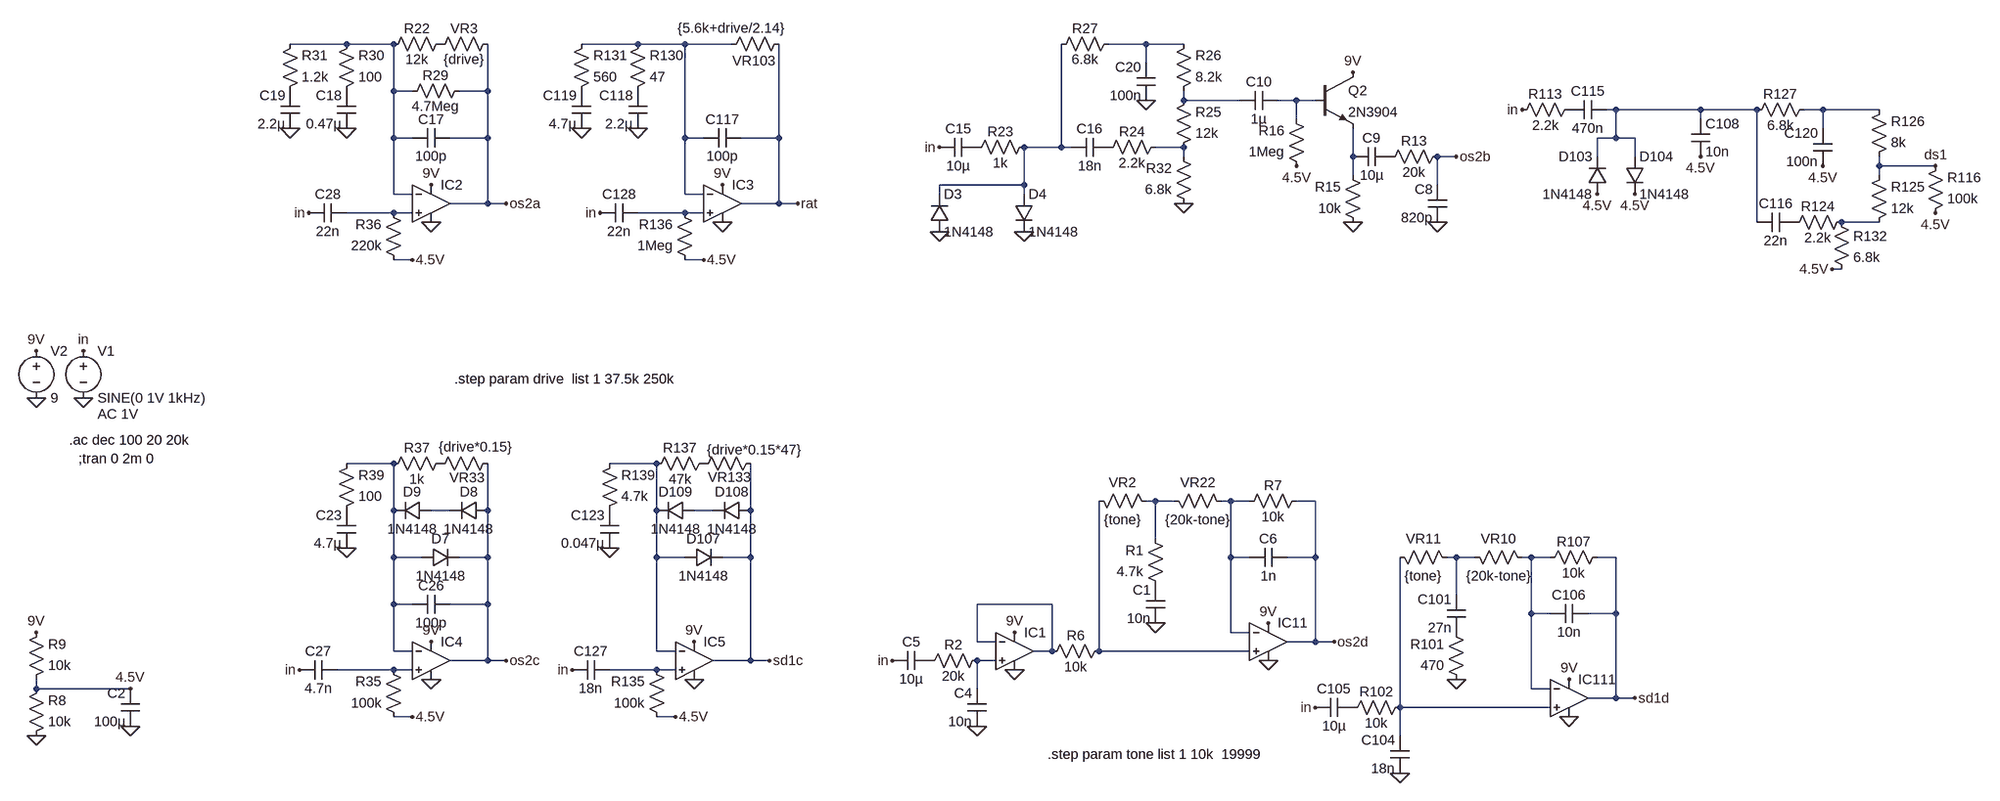
[diagram p0: schematic os2.asc]
os2.asc, the LTspice schematic file:
Version 4
SHEET 1 3148 2804
WIRE -1536 624 -1632 624
WIRE -1456 624 -1536 624
WIRE -1040 624 -1136 624
WIRE -960 624 -1040 624
WIRE -880 624 -960 624
WIRE -128 624 -192 624
WIRE -64 624 -128 624
WIRE -128 656 -128 624
WIRE -1456 704 -1456 624
WIRE -1424 704 -1456 704
WIRE -1296 704 -1296 624
WIRE -1296 704 -1344 704
WIRE -64 720 -64 704
WIRE 32 720 -64 720
WIRE 128 720 96 720
WIRE 160 720 128 720
WIRE 672 736 656 736
WIRE 816 736 672 736
WIRE 912 736 816 736
WIRE 1024 736 992 736
WIRE 1120 736 1024 736
WIRE 128 752 128 720
WIRE 816 752 816 736
WIRE 1024 768 1024 736
WIRE -1456 784 -1456 704
WIRE -1424 784 -1456 784
WIRE -1296 784 -1296 704
WIRE -1296 784 -1360 784
WIRE -960 784 -960 624
WIRE -928 784 -960 784
WIRE -800 784 -800 624
WIRE -800 784 -864 784
WIRE 672 784 672 736
WIRE 672 784 640 784
WIRE 704 784 672 784
WIRE -272 800 -272 624
WIRE -272 800 -336 800
WIRE -256 800 -272 800
WIRE -64 800 -112 800
WIRE -64 816 -64 800
WIRE 224 816 224 768
WIRE 400 816 368 816
WIRE 640 816 640 784
WIRE 704 816 704 784
WIRE 1120 832 1120 816
WIRE 1216 832 1120 832
WIRE 224 848 224 816
WIRE 1120 848 1120 832
WIRE -336 864 -336 800
WIRE -336 864 -480 864
WIRE 368 864 368 816
WIRE -1456 880 -1456 784
WIRE -1424 880 -1456 880
WIRE -960 880 -960 784
WIRE -928 880 -960 880
WIRE -480 880 -480 864
WIRE -336 880 -336 864
WIRE -1296 896 -1296 784
WIRE -1296 896 -1360 896
WIRE -1264 896 -1296 896
WIRE -800 896 -800 784
WIRE -800 896 -864 896
WIRE -768 896 -800 896
WIRE -1456 912 -1536 912
WIRE -1424 912 -1456 912
WIRE -960 912 -1040 912
WIRE -928 912 -960 912
WIRE 912 928 912 736
WIRE 1120 928 1056 928
WIRE -1424 992 -1456 992
WIRE -928 992 -960 992
WIRE 1056 1008 1040 1008
WIRE -1456 1376 -1536 1376
WIRE -1008 1376 -1088 1376
WIRE -112 1440 -128 1440
WIRE -80 1440 -112 1440
WIRE 16 1440 0 1440
WIRE 48 1440 16 1440
WIRE 160 1440 128 1440
WIRE -1456 1456 -1456 1376
WIRE -1360 1456 -1392 1456
WIRE -1296 1456 -1296 1376
WIRE -1008 1456 -1008 1376
WIRE -912 1456 -944 1456
WIRE -848 1456 -848 1376
WIRE -112 1504 -112 1440
WIRE -1456 1536 -1456 1456
WIRE -1408 1536 -1456 1536
WIRE -1296 1536 -1296 1456
WIRE -1296 1536 -1344 1536
WIRE -1008 1536 -1008 1456
WIRE -960 1536 -1008 1536
WIRE -848 1536 -848 1456
WIRE -848 1536 -896 1536
WIRE 16 1536 16 1440
WIRE 48 1536 16 1536
WIRE 160 1536 160 1440
WIRE 160 1536 112 1536
WIRE 400 1536 384 1536
WIRE 432 1536 400 1536
WIRE 528 1536 512 1536
WIRE 560 1536 528 1536
WIRE 672 1536 640 1536
WIRE 400 1600 400 1536
WIRE -1456 1616 -1456 1536
WIRE -1424 1616 -1456 1616
WIRE -1296 1616 -1296 1536
WIRE -1296 1616 -1360 1616
WIRE -288 1616 -416 1616
WIRE 528 1632 528 1536
WIRE 560 1632 528 1632
WIRE 672 1632 672 1536
WIRE 672 1632 624 1632
WIRE 16 1664 16 1536
WIRE 48 1664 16 1664
WIRE -416 1680 -416 1616
WIRE -384 1680 -416 1680
WIRE 160 1680 160 1536
WIRE 160 1680 112 1680
WIRE 192 1680 160 1680
WIRE -1456 1696 -1456 1616
WIRE -1424 1696 -1456 1696
WIRE -1008 1696 -1008 1536
WIRE -976 1696 -1008 1696
WIRE -288 1696 -288 1616
WIRE -288 1696 -320 1696
WIRE -208 1696 -208 1440
WIRE 48 1696 -208 1696
WIRE -1296 1712 -1296 1616
WIRE -1296 1712 -1360 1712
WIRE -1264 1712 -1296 1712
WIRE -848 1712 -848 1536
WIRE -848 1712 -912 1712
WIRE -816 1712 -848 1712
WIRE -384 1712 -416 1712
WIRE -1456 1728 -1552 1728
WIRE -1424 1728 -1456 1728
WIRE -1008 1728 -1088 1728
WIRE -976 1728 -1008 1728
WIRE -2064 1760 -2064 1744
WIRE -1904 1760 -2064 1760
WIRE -416 1760 -416 1712
WIRE 528 1760 528 1632
WIRE 560 1760 528 1760
WIRE 672 1776 672 1632
WIRE 672 1776 624 1776
WIRE 704 1776 672 1776
WIRE 304 1792 304 1536
WIRE 560 1792 304 1792
WIRE -1424 1808 -1456 1808
WIRE -976 1808 -1008 1808
WIRE 304 1840 304 1792
FLAG -1984 1264 0
FLAG -1984 1184 in
FLAG -1600 912 in
FLAG -2064 1840 0
FLAG -1904 1824 0
FLAG -1392 864 9V
FLAG -2064 1264 0
FLAG -2064 1184 9V
FLAG -2064 1664 9V
FLAG -1904 1760 4.5V
FLAG -1424 992 4.5V
FLAG -1536 768 0
FLAG -1632 768 0
FLAG -1392 928 0
FLAG -336 944 0
FLAG -480 944 0
FLAG -128 720 0
FLAG -64 896 0
FLAG 128 832 4.5V
FLAG 224 928 0
FLAG 224 672 9V
FLAG 368 928 0
FLAG -480 800 in
FLAG -1264 896 os2a
FLAG 400 816 os2b
FLAG -1616 1728 in
FLAG -1392 1680 9V
FLAG -1424 1808 4.5V
FLAG -1536 1520 0
FLAG -1392 1744 0
FLAG -416 1824 0
FLAG -1264 1712 os2c
FLAG 80 1648 9V
FLAG 80 1712 0
FLAG 192 1680 os2d
FLAG -112 1648 0
FLAG 640 880 4.5V
FLAG 704 880 4.5V
FLAG 816 816 4.5V
FLAG 1024 832 4.5V
FLAG 1040 1008 4.5V
FLAG 1216 832 ds1
FLAG 512 736 in
FLAG -1104 912 in
FLAG -896 864 9V
FLAG -928 992 4.5V
FLAG -1040 768 0
FLAG -1136 768 0
FLAG -896 928 0
FLAG -768 896 rat
FLAG -1152 1728 in
FLAG -944 1680 9V
FLAG -976 1808 4.5V
FLAG -1088 1520 0
FLAG -944 1744 0
FLAG -816 1712 sd1c
FLAG 304 1904 0
FLAG 592 1744 9V
FLAG 592 1808 0
FLAG 704 1776 sd1d
FLAG 400 1744 0
FLAG -352 1664 9V
FLAG -352 1728 0
FLAG 1216 912 4.5V
FLAG -560 1712 in
FLAG 160 1792 in
SYMBOL voltage -1984 1168 R0
WINDOW 123 24 124 Left 2
WINDOW 39 0 0 Left 2
SYMATTR Value2 AC 1V
SYMATTR InstName V1
SYMATTR Value SINE(0 1V 1kHz)
SYMBOL res -1280 608 R90
WINDOW 0 5 56 VBottom 2
WINDOW 3 27 56 VTop 2
SYMATTR InstName VR3
SYMATTR Value {drive}
SYMBOL res -1440 1008 R180
WINDOW 0 36 76 Left 2
WINDOW 3 36 40 Left 2
SYMATTR InstName R36
SYMATTR Value 220k
SYMBOL cap -1536 896 R90
WINDOW 0 0 32 VBottom 2
WINDOW 3 32 32 VTop 2
SYMATTR InstName C28
SYMATTR Value 22n
SYMBOL res -1552 720 M180
WINDOW 0 36 76 Left 2
WINDOW 3 36 40 Left 2
SYMATTR InstName R30
SYMATTR Value 100
SYMBOL res -1328 688 R90
WINDOW 0 5 56 VBottom 2
WINDOW 3 27 56 VTop 2
SYMATTR InstName R29
SYMATTR Value 4.7Meg
SYMBOL res -1360 608 R90
WINDOW 0 5 56 VBottom 2
WINDOW 3 27 56 VTop 2
SYMATTR InstName R22
SYMATTR Value 12k
SYMBOL cap -1360 768 R90
WINDOW 0 0 32 VBottom 2
WINDOW 3 32 32 VTop 2
SYMATTR InstName C17
SYMATTR Value 100p
SYMBOL npn 160 672 R0
SYMATTR InstName Q2
SYMATTR Value 2N3904
SYMBOL res -2080 1760 M180
WINDOW 0 36 76 Left 2
WINDOW 3 36 40 Left 2
SYMATTR InstName R9
SYMATTR Value 10k
SYMBOL res -2080 1856 M180
WINDOW 0 36 76 Left 2
WINDOW 3 36 40 Left 2
SYMATTR InstName R8
SYMATTR Value 10k
SYMBOL cap -1888 1824 R180
WINDOW 0 24 56 Left 2
WINDOW 3 24 8 Left 2
SYMATTR InstName C2
SYMATTR Value 100µ
SYMBOL voltage -2064 1168 R0
WINDOW 123 0 0 Left 0
WINDOW 39 0 0 Left 0
SYMATTR InstName V2
SYMATTR Value 9
SYMBOL res -1648 720 M180
WINDOW 0 36 76 Left 2
WINDOW 3 36 40 Left 2
SYMATTR InstName R31
SYMATTR Value 1.2k
SYMBOL cap -1520 768 R180
WINDOW 0 24 56 Left 2
WINDOW 3 24 8 Left 2
SYMATTR InstName C18
SYMATTR Value 0.47µ
SYMBOL cap -1616 768 R180
WINDOW 0 24 56 Left 2
WINDOW 3 24 8 Left 2
SYMATTR InstName C19
SYMATTR Value 2.2µ
SYMBOL cap -416 784 R90
WINDOW 0 0 32 VBottom 2
WINDOW 3 32 32 VTop 2
SYMATTR InstName C15
SYMATTR Value 10µ
SYMBOL res -320 784 R90
WINDOW 0 5 56 VBottom 2
WINDOW 3 27 56 VTop 2
SYMATTR InstName R23
SYMATTR Value 1k
SYMBOL diode -496 944 M180
WINDOW 0 24 64 Left 2
WINDOW 3 24 0 Left 2
SYMATTR InstName D3
SYMATTR Value 1N4148
SYMBOL diode -352 880 R0
SYMATTR InstName D4
SYMATTR Value 1N4148
SYMBOL cap -192 784 R90
WINDOW 0 0 32 VBottom 2
WINDOW 3 32 32 VTop 2
SYMATTR InstName C16
SYMATTR Value 18n
SYMBOL res -176 608 R90
WINDOW 0 5 56 VBottom 2
WINDOW 3 27 56 VTop 2
SYMATTR InstName R27
SYMATTR Value 6.8k
SYMBOL cap -112 720 R180
WINDOW 0 24 56 Left 2
WINDOW 3 24 8 Left 2
SYMATTR InstName C20
SYMATTR Value 100n
SYMBOL res -96 784 R90
WINDOW 0 5 56 VBottom 2
WINDOW 3 27 56 VTop 2
SYMATTR InstName R24
SYMATTR Value 2.2k
SYMBOL res -48 912 R180
WINDOW 0 36 76 Left 2
WINDOW 3 36 40 Left 2
SYMATTR InstName R32
SYMATTR Value 6.8k
SYMBOL res -80 816 M180
WINDOW 0 36 76 Left 2
WINDOW 3 36 40 Left 2
SYMATTR InstName R25
SYMATTR Value 12k
SYMBOL res -80 720 M180
WINDOW 0 36 76 Left 2
WINDOW 3 36 40 Left 2
SYMATTR InstName R26
SYMATTR Value 8.2k
SYMBOL cap 96 704 R90
WINDOW 0 0 32 VBottom 2
WINDOW 3 32 32 VTop 2
SYMATTR InstName C10
SYMATTR Value 1µ
SYMBOL res 144 848 R180
WINDOW 0 36 76 Left 2
WINDOW 3 36 40 Left 2
SYMATTR InstName R16
SYMATTR Value 1Meg
SYMBOL cap 288 800 R90
WINDOW 0 0 32 VBottom 2
WINDOW 3 32 32 VTop 2
SYMATTR InstName C9
SYMATTR Value 10µ
SYMBOL res 240 944 R180
WINDOW 0 36 76 Left 2
WINDOW 3 36 40 Left 2
SYMATTR InstName R15
SYMATTR Value 10k
SYMBOL res 384 800 R90
WINDOW 0 5 56 VBottom 2
WINDOW 3 27 56 VTop 2
SYMATTR InstName R13
SYMATTR Value 20k
SYMBOL cap 384 928 R180
WINDOW 0 24 56 Left 2
WINDOW 3 24 8 Left 2
SYMATTR InstName C8
SYMATTR Value 820p
SYMBOL res -1280 1360 R90
WINDOW 0 56 51 VBottom 2
WINDOW 3 -28 36 VTop 2
SYMATTR InstName VR33
SYMATTR Value {drive*0.15}
SYMBOL res -1440 1824 R180
WINDOW 0 36 76 Left 2
WINDOW 3 36 40 Left 2
SYMATTR InstName R35
SYMATTR Value 100k
SYMBOL cap -1552 1712 R90
WINDOW 0 0 32 VBottom 2
WINDOW 3 32 32 VTop 2
SYMATTR InstName C27
SYMATTR Value 4.7n
SYMBOL res -1552 1472 M180
WINDOW 0 36 76 Left 2
WINDOW 3 36 40 Left 2
SYMATTR InstName R39
SYMATTR Value 100
SYMBOL res -1360 1360 R90
WINDOW 0 5 56 VBottom 2
WINDOW 3 27 56 VTop 2
SYMATTR InstName R37
SYMATTR Value 1k
SYMBOL cap -1360 1600 R90
WINDOW 0 0 32 VBottom 2
WINDOW 3 32 32 VTop 2
SYMATTR InstName C26
SYMATTR Value 100p
SYMBOL cap -1520 1520 R180
WINDOW 0 24 56 Left 2
WINDOW 3 24 8 Left 2
SYMATTR InstName C23
SYMATTR Value 4.7µ
SYMBOL diode -1392 1440 R90
WINDOW 0 0 32 VBottom 2
WINDOW 3 32 32 VTop 2
SYMATTR InstName D9
SYMATTR Value 1N4148
SYMBOL diode -1296 1440 R90
WINDOW 0 0 32 VBottom 2
WINDOW 3 32 32 VTop 2
SYMATTR InstName D8
SYMATTR Value 1N4148
SYMBOL diode -1408 1552 R270
WINDOW 0 32 32 VTop 2
WINDOW 3 0 32 VBottom 2
SYMATTR InstName D7
SYMATTR Value 1N4148
SYMBOL cap -496 1696 R90
WINDOW 0 0 32 VBottom 2
WINDOW 3 32 32 VTop 2
SYMATTR InstName C5
SYMATTR Value 10µ
SYMBOL res -400 1696 R90
WINDOW 0 5 56 VBottom 2
WINDOW 3 27 56 VTop 2
SYMATTR InstName R2
SYMATTR Value 20k
SYMBOL cap -400 1824 R180
WINDOW 0 24 56 Left 2
WINDOW 3 24 8 Left 2
SYMATTR InstName C4
SYMATTR Value 10n
SYMBOL res -192 1680 R90
WINDOW 0 5 56 VBottom 2
WINDOW 3 27 56 VTop 2
SYMATTR InstName R6
SYMATTR Value 10k
SYMBOL Opamps\\UniversalOpamp2 80 1680 R0
SYMATTR InstName IC11
SYMBOL cap 112 1520 R90
WINDOW 0 0 32 VBottom 2
WINDOW 3 32 32 VTop 2
SYMATTR InstName C6
SYMATTR Value 1n
SYMBOL res 144 1424 R90
WINDOW 0 5 56 VBottom 2
WINDOW 3 27 56 VTop 2
SYMATTR InstName R7
SYMATTR Value 10k
SYMBOL res -96 1424 M90
WINDOW 0 0 56 VBottom 2
WINDOW 3 32 56 VTop 2
SYMATTR InstName VR22
SYMATTR Value {20k-tone}
SYMBOL res -224 1424 M90
WINDOW 0 0 56 VBottom 2
WINDOW 3 32 56 VTop 2
SYMATTR InstName VR2
SYMATTR Value {tone}
SYMBOL res -96 1600 R180
WINDOW 0 36 76 Left 2
WINDOW 3 36 40 Left 2
SYMATTR InstName R1
SYMATTR Value 4.7k
SYMBOL cap -96 1648 R180
WINDOW 0 24 56 Left 2
WINDOW 3 24 8 Left 2
SYMATTR InstName C1
SYMATTR Value 10n
SYMBOL cap 656 720 R90
WINDOW 0 0 32 VBottom 2
WINDOW 3 32 32 VTop 2
SYMATTR InstName C115
SYMATTR Value 470n
SYMBOL diode 656 880 R180
WINDOW 0 24 64 Left 2
WINDOW 3 24 0 Left 2
SYMATTR InstName D103
SYMATTR Value 1N4148
SYMBOL diode 688 816 R0
SYMATTR InstName D104
SYMATTR Value 1N4148
SYMBOL cap 800 816 M180
WINDOW 0 24 56 Left 2
WINDOW 3 24 8 Left 2
SYMATTR InstName C108
SYMATTR Value 10n
SYMBOL res 1008 720 R90
WINDOW 0 5 56 VBottom 2
WINDOW 3 27 56 VTop 2
SYMATTR InstName R127
SYMATTR Value 6.8k
SYMBOL cap 1040 832 R180
WINDOW 0 24 56 Left 2
WINDOW 3 24 8 Left 2
SYMATTR InstName C120
SYMATTR Value 100n
SYMBOL cap 976 912 R90
WINDOW 0 0 32 VBottom 2
WINDOW 3 32 32 VTop 2
SYMATTR InstName C116
SYMATTR Value 22n
SYMBOL res 1072 912 R90
WINDOW 0 5 56 VBottom 2
WINDOW 3 27 56 VTop 2
SYMATTR InstName R124
SYMATTR Value 2.2k
SYMBOL res 1040 912 R0
SYMATTR InstName R132
SYMATTR Value 6.8k
SYMBOL res 1104 832 M180
WINDOW 0 36 76 Left 2
WINDOW 3 36 40 Left 2
SYMATTR InstName R126
SYMATTR Value 8k
SYMBOL res 1104 944 M180
WINDOW 0 36 76 Left 2
WINDOW 3 36 40 Left 2
SYMATTR InstName R125
SYMATTR Value 12k
SYMBOL res 608 720 R90
WINDOW 0 5 56 VBottom 2
WINDOW 3 27 56 VTop 2
SYMATTR InstName R113
SYMATTR Value 2.2k
SYMBOL res -784 608 R90
WINDOW 0 60 58 VBottom 2
WINDOW 3 -27 97 VTop 2
SYMATTR InstName VR103
SYMATTR Value {5.6k+drive/2.14}
SYMBOL res -944 1008 R180
WINDOW 0 36 76 Left 2
WINDOW 3 36 40 Left 2
SYMATTR InstName R136
SYMATTR Value 1Meg
SYMBOL cap -1040 896 R90
WINDOW 0 0 32 VBottom 2
WINDOW 3 32 32 VTop 2
SYMATTR InstName C128
SYMATTR Value 22n
SYMBOL res -1056 720 M180
WINDOW 0 36 76 Left 2
WINDOW 3 36 40 Left 2
SYMATTR InstName R130
SYMATTR Value 47
SYMBOL cap -864 768 R90
WINDOW 0 0 32 VBottom 2
WINDOW 3 32 32 VTop 2
SYMATTR InstName C117
SYMATTR Value 100p
SYMBOL res -1152 720 M180
WINDOW 0 36 76 Left 2
WINDOW 3 36 40 Left 2
SYMATTR InstName R131
SYMATTR Value 560
SYMBOL cap -1024 768 R180
WINDOW 0 24 56 Left 2
WINDOW 3 24 8 Left 2
SYMATTR InstName C118
SYMATTR Value 2.2µ
SYMBOL cap -1120 768 R180
WINDOW 0 24 56 Left 2
WINDOW 3 24 8 Left 2
SYMATTR InstName C119
SYMATTR Value 4.7µ
SYMBOL res -832 1360 R90
WINDOW 0 55 52 VBottom 2
WINDOW 3 -23 10 VTop 2
SYMATTR InstName VR133
SYMATTR Value {drive*0.15*47}
SYMBOL res -992 1824 R180
WINDOW 0 36 76 Left 2
WINDOW 3 36 40 Left 2
SYMATTR InstName R135
SYMATTR Value 100k
SYMBOL cap -1088 1712 R90
WINDOW 0 0 32 VBottom 2
WINDOW 3 32 32 VTop 2
SYMATTR InstName C127
SYMATTR Value 18n
SYMBOL res -1104 1472 M180
WINDOW 0 36 76 Left 2
WINDOW 3 36 40 Left 2
SYMATTR InstName R139
SYMATTR Value 4.7k
SYMBOL res -912 1360 R90
WINDOW 0 5 56 VBottom 2
WINDOW 3 27 56 VTop 2
SYMATTR InstName R137
SYMATTR Value 47k
SYMBOL cap -1072 1520 R180
WINDOW 0 24 56 Left 2
WINDOW 3 24 8 Left 2
SYMATTR InstName C123
SYMATTR Value 0.047µ
SYMBOL diode -944 1440 R90
WINDOW 0 0 32 VBottom 2
WINDOW 3 32 32 VTop 2
SYMATTR InstName D109
SYMATTR Value 1N4148
SYMBOL diode -848 1440 R90
WINDOW 0 0 32 VBottom 2
WINDOW 3 32 32 VTop 2
SYMATTR InstName D108
SYMATTR Value 1N4148
SYMBOL diode -960 1552 R270
WINDOW 0 32 32 VTop 2
WINDOW 3 0 32 VBottom 2
SYMATTR InstName D107
SYMATTR Value 1N4148
SYMBOL cap 224 1776 R90
WINDOW 0 0 32 VBottom 2
WINDOW 3 32 32 VTop 2
SYMATTR InstName C105
SYMATTR Value 10µ
SYMBOL res 320 1776 R90
WINDOW 0 5 56 VBottom 2
WINDOW 3 27 56 VTop 2
SYMATTR InstName R102
SYMATTR Value 10k
SYMBOL cap 320 1904 R180
WINDOW 0 24 56 Left 2
WINDOW 3 24 8 Left 2
SYMATTR InstName C104
SYMATTR Value 18n
SYMBOL Opamps\\UniversalOpamp2 592 1776 R0
SYMATTR InstName IC111
SYMBOL cap 624 1616 R90
WINDOW 0 0 32 VBottom 2
WINDOW 3 32 32 VTop 2
SYMATTR InstName C106
SYMATTR Value 10n
SYMBOL res 656 1520 R90
WINDOW 0 5 56 VBottom 2
WINDOW 3 27 56 VTop 2
SYMATTR InstName R107
SYMATTR Value 10k
SYMBOL res 416 1520 M90
WINDOW 0 0 56 VBottom 2
WINDOW 3 32 56 VTop 2
SYMATTR InstName VR10
SYMATTR Value {20k-tone}
SYMBOL res 288 1520 M90
WINDOW 0 0 56 VBottom 2
WINDOW 3 32 56 VTop 2
SYMATTR InstName VR11
SYMATTR Value {tone}
SYMBOL res 416 1760 R180
WINDOW 0 36 76 Left 2
WINDOW 3 36 40 Left 2
SYMATTR InstName R101
SYMATTR Value 470
SYMBOL cap 416 1664 R180
WINDOW 0 24 56 Left 2
WINDOW 3 24 8 Left 2
SYMATTR InstName C101
SYMATTR Value 27n
SYMBOL Opamps\\UniversalOpamp2 -352 1696 R0
SYMATTR InstName IC1
SYMBOL res 1200 928 M180
WINDOW 0 36 76 Left 2
WINDOW 3 36 40 Left 2
SYMATTR InstName R116
SYMATTR Value 100k
SYMBOL Opamps\\UniversalOpamp2 -1392 896 R0
SYMATTR InstName IC2
SYMBOL Opamps\\UniversalOpamp2 -896 896 R0
SYMATTR InstName IC3
SYMBOL Opamps\\UniversalOpamp2 -1392 1712 R0
SYMATTR InstName IC4
SYMBOL Opamps\\UniversalOpamp2 -944 1712 R0
SYMATTR InstName IC5
TEXT -2008 1336 Left 2 !.ac dec 100 20 20k
TEXT -1992 1368 Left 2 !;tran 0 2m 0
TEXT -296 1872 Left 2 !.step param tone list 1 10k  19999
TEXT -1352 1232 Left 2 !.step param drive  list 1 37.5k 250k

The netlist it stands for:
* os2.asc
V1 in 0 SINE(0 1V 1kHz) AC 1V
R§VR3 os2a P001 {drive}
R36 4.5V N011 220k
C28 N011 in 22n
R30 P002 N001 100
R29 os2a N001 4.7Meg
R22 P001 N001 12k
C17 os2a N001 100p
Q2 9V N005 N010 0 2N3904
R9 4.5V 9V 10k
R8 0 4.5V 10k
C2 0 4.5V 100µ
V2 9V 0 9
R31 P003 N001 1.2k
C18 0 P002 0.47µ
C19 0 P003 2.2µ
C15 P004 in 10µ
R23 N008 P004 1k
D3 0 N008 1N4148
D4 N008 0 1N4148
C16 P005 N008 18n
R27 N003 N008 6.8k
C20 0 N003 100n
R24 N009 P005 2.2k
R32 0 N009 6.8k
R25 N009 N004 12k
R26 N004 N003 8.2k
C10 N005 N004 1µ
R16 4.5V N005 1Meg
C9 P006 N010 10µ
R15 0 N010 10k
R13 os2b P006 20k
C8 0 os2b 820p
R§VR33 os2c P007 {drive*0.15}
R35 4.5V N025 100k
C27 N025 in 4.7n
R39 P008 N014 100
R37 P007 N014 1k
C26 os2c N014 100p
C23 0 P008 4.7µ
D9 N018 N014 1N4148
D8 os2c N018 1N4148
D7 N014 os2c 1N4148
C5 P009 in 10µ
R2 N024 P009 20k
C4 0 N024 10n
R6 N023 N022 10k
XIC11 N023 N017 9V 0 os2d level.2 Avol=1Meg GBW=10Meg Slew=10Meg ilimit=25m rail=0 Vos=0 phimargin=45 en=0 enk=0 in=0 ink=0 Rin=500Meg  ; pins IN+ IN- V+ V- OUT
C6 os2d N017 1n
R7 os2d N017 10k
R§VR22 N016 N017 {20k-tone}
R§VR2 N023 N016 {tone}
R1 P010 N016 4.7k
C1 0 P010 10n
C115 N006 P011 470n
D103 4.5V N006 1N4148
D104 N006 4.5V 1N4148
C108 4.5V N006 10n
R127 N007 N006 6.8k
C120 4.5V N007 100n
C116 P012 N006 22n
R124 N013 P012 2.2k
R132 N013 4.5V 6.8k
R126 ds1 N007 8k
R125 N013 ds1 12k
R113 P011 in 2.2k
R§VR103 rat N002 {5.6k+drive/2.14}
R136 4.5V N012 1Meg
C128 N012 in 22n
R130 P013 N002 47
C117 rat N002 100p
R131 P014 N002 560
C118 0 P013 2.2µ
C119 0 P014 4.7µ
R§VR133 sd1c P015 {drive*0.15*47}
R135 4.5V N026 100k
C127 N026 in 18n
R139 P016 N015 4.7k
R137 P015 N015 47k
C123 0 P016 0.047µ
D109 N019 N015 1N4148
D108 sd1c N019 1N4148
D107 N015 sd1c 1N4148
C105 P017 in 10µ
R102 N027 P017 10k
C104 0 N027 18n
XIC111 N027 N021 9V 0 sd1d level.2 Avol=1Meg GBW=10Meg Slew=10Meg ilimit=25m rail=0 Vos=0 phimargin=45 en=0 enk=0 in=0 ink=0 Rin=500Meg  ; pins IN+ IN- V+ V- OUT
C106 sd1d N021 10n
R107 sd1d N021 10k
R§VR10 N020 N021 {20k-tone}
R§VR11 N027 N020 {tone}
R101 0 P018 470
C101 P018 N020 27n
XIC1 N024 N022 9V 0 N022 level.2 Avol=1Meg GBW=10Meg Slew=10Meg ilimit=25m rail=0 Vos=0 phimargin=45 en=0 enk=0 in=0 ink=0 Rin=500Meg  ; pins IN+ IN- V+ V- OUT
R116 4.5V ds1 100k
XIC2 N011 N001 9V 0 os2a level.2 Avol=1Meg GBW=10Meg Slew=10Meg ilimit=25m rail=0 Vos=0 phimargin=45 en=0 enk=0 in=0 ink=0 Rin=500Meg  ; pins IN+ IN- V+ V- OUT
XIC3 N012 N002 9V 0 rat level.2 Avol=1Meg GBW=10Meg Slew=10Meg ilimit=25m rail=0 Vos=0 phimargin=45 en=0 enk=0 in=0 ink=0 Rin=500Meg  ; pins IN+ IN- V+ V- OUT
XIC4 N025 N014 9V 0 os2c level.2 Avol=1Meg GBW=10Meg Slew=10Meg ilimit=25m rail=0 Vos=0 phimargin=45 en=0 enk=0 in=0 ink=0 Rin=500Meg  ; pins IN+ IN- V+ V- OUT
XIC5 N026 N015 9V 0 sd1c level.2 Avol=1Meg GBW=10Meg Slew=10Meg ilimit=25m rail=0 Vos=0 phimargin=45 en=0 enk=0 in=0 ink=0 Rin=500Meg  ; pins IN+ IN- V+ V- OUT
.model D D
.lib standard.dio
.model NPN NPN
.model PNP PNP
.lib standard.bjt
.ac dec 100 20 20k
;tran 0 2m 0
.step param tone list 1 10k  19999
.step param drive  list 1 37.5k 250k
.lib UniversalOpamps2.sub
.backanno
.end